# Altium schematic sheet 1_P1.schdoc
size 307 x 218 mm; Symbol: Drawing-Symbol_A4; Device: Drawing-Symbol_A4; Company: 嘉立创EDA; Version: V1.0; Page Size: A4; @Project Name: New Project_2025-01-19_22-01-16; @Page Count: 1; @Update Date: 2025-03-09; @Create Date: 2025-01-19; @Schematic Name: Schematic1; @Page No: 1; @Page Name: P1; @Create Time: 14:01:20; @Update Time: 12:35:36; Width: 1170; Height: 825; Region Start: 1; X Region Count: 6; Y Region Count: 4; Blade Width: 10; Title Block Position: 3; @Board Name: Board1
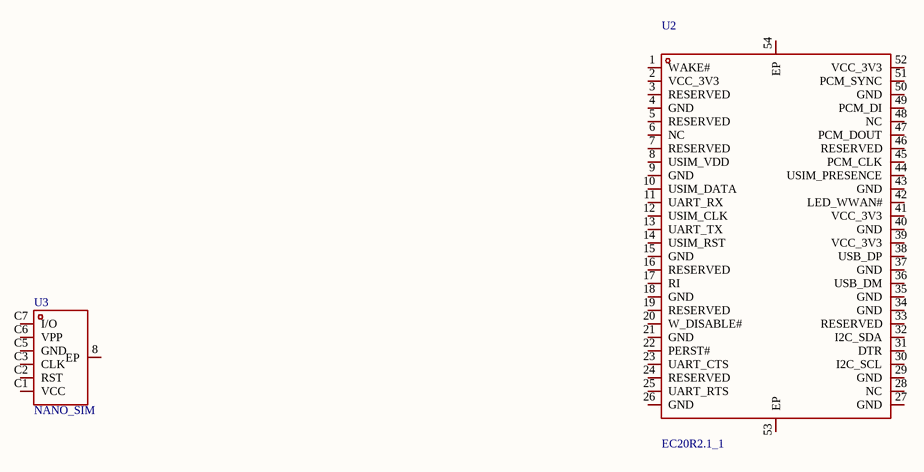
[diagram p0: 1_P1.schdoc]

## Parts
U2  EC20R2.1_1  [CONN-SMD_52P-P0.80_EC20R2.1MINIPCIE-C]
U3  NANO_SIM  [SIM-SMD_XKB_XKNANO-1151]

## Nets

Not connected (* = marked no-connect by the designer): U2 1(WAKE#) 2(VCC_3V3) 3(RESERVED) 4(GND) 5(RESERVED) 6(NC) 7(RESERVED) 8(USIM_VDD) 9(GND) 10(USIM_DATA) 11(UART_RX) 12(USIM_CLK) 13(UART_TX) 14(USIM_RST) 15(GND) 16(RESERVED) 17(RI) 18(GND) 19(RESERVED) 20(W_DISABLE#) 21(GND) 22(PERST#) 23(UART_CTS) 24(RESERVED) 25(UART_RTS) 26(GND) 27(GND) 28(NC) 29(GND) 30(I2C_SCL) 31(DTR) 32(I2C_SDA) 33(RESERVED) 34(GND) 35(GND) 36(USB_DM) 37(GND) 38(USB_DP) 39(VCC_3V3) 40(GND) 41(VCC_3V3) 42(LED_WWAN#) 43(GND) 44(USIM_PRESENCE) 45(PCM_CLK) 46(RESERVED) 47(PCM_DOUT) 48(NC) 49(PCM_DI) 50(GND) 51(PCM_SYNC) 52(VCC_3V3) 53(EP) 54(EP); U3 8(EP) C1(VCC) C2(RST) C3(CLK) C5(GND) C6(VPP) C7(I/O)

## Notes on the sheet
- 1
- 2
- 3
- 4
- 5
- 6
- A
- B
- C
- 原理图
- Schematic1
- 创建日期
- 更新日期
- 2025-01-19
- 2025-03-09
- 板子
- 绘制
- Board1
- 图页
- P1
- D
- 审阅
- 版本
- 尺寸
- New Project_2025-01-19_22-01-16
- 页    1    共    1
- V1.0
- A4
- 嘉立创EDA

## Library data of the parts
U2 = EC20R2.1_1: Add into BOM: yes; Symbol: EC20R2.1_1; Device: EC20R2.1_1; LCSC Part Name: EC20R2.1_1; Supplier Part: C9900092251; Manufacturer Part: EC20R2.1_1; Supplier Footprint: EC200D; JLCPCB Part Class: 扩展库; Supplier: LCSC; Convert to PCB: yes
U3 = NANO_SIM: Add into BOM: yes; Symbol: NANO_SIM; Device: NANO_SIM; LCSC Part Name: NANO_SIM; Supplier Part: C9900014790; Manufacturer Part: NANO_SIM; Supplier Footprint: SMD_SIM; JLCPCB Part Class: 扩展库; Supplier: LCSC; Convert to PCB: yes